# Altium project KeetV2.PrjPCB (part 3 of 6)
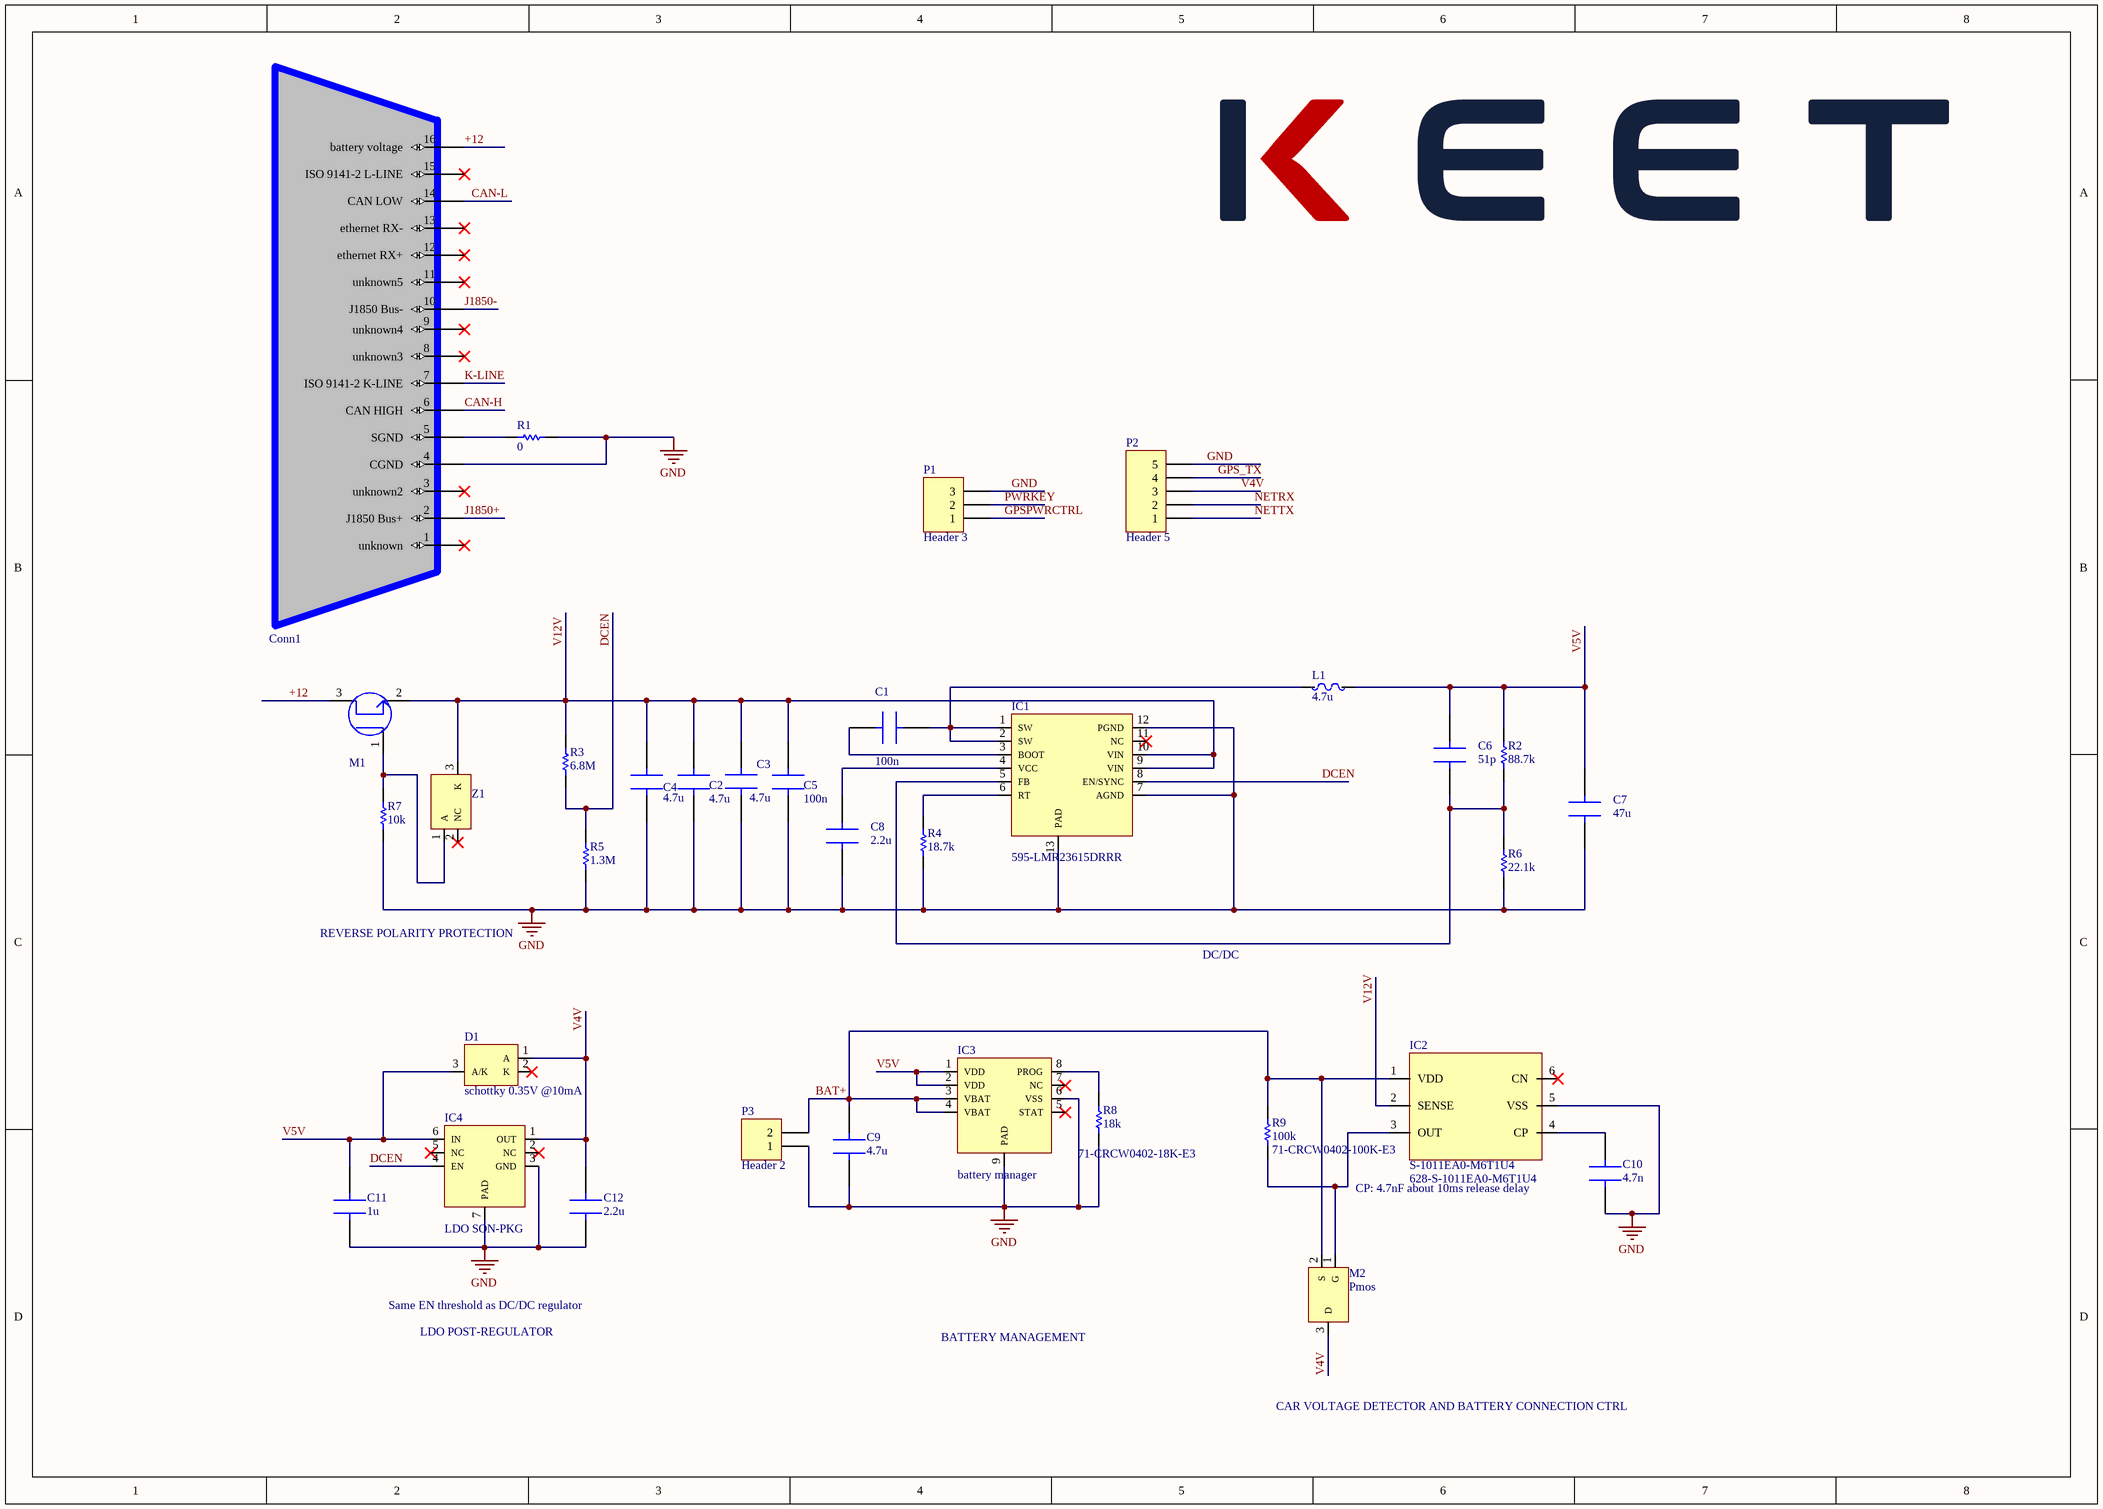
[diagram p4: PowerSupply.SchDoc]

## Sheet PowerSupply.SchDoc (continued)

### Library data of the parts (continued)
R9 = CRCW0402100KFKED: Res Thick Film 0402 100K Ohm 1% 1/16W 100ppm/C Molded SMD Paper T/R; Manufacturer: Vishay; Power Rating: 63mW; Resistance: 100kR; Temperature Coefficient: 100ppm/°C; Voltage Rating: 50V; Supplier 1: Mouser; Manufacturer Part Number: CRCW0402100KFKED; RoHS: Yes; Category: Chip SMD Resistors; Stock 1: 350931; Pricing 1: 1=0,10000, 10=0,03300, 50=0,03300, 100=0,01400, 1000=0,00600, 10000=0,00500 (USD); Mount: Surface Mount; Case/Package: 0402; Number of Pins: 2; Contact Plating: Tin; Weight: 2.3E-05oz; Case Code (Metric): 1005; Case Code (Imperial): 0402; Size Code: 0402; Min Operating Temperature: -55°C; Max Operating Temperature: 155°C; Tolerance: 1%; Resistor Type: Thick Film; Termination: SMD/SMT; Packaging: Tape and Reel; Package Quantity: 10000; Number of Terminations: 2; Max Power Dissipation: 63mW; Voltage Rating (DC): 50V; Features: Automotive AEC-Q200; Series: CRCW; Technology: THICK FILM; Construction: Rectangular; Resistance Tolerance: 1%; Length: 1mm; Width: 0.02inch; Height: 0.35mm; Depth: 0.5mm; Radiation Hardening: No; Lead Free: Lead Free; RoHS Compliant: Yes; REACH SVHC: Unknown; Military Standard: Not; ComponentLink1URL: https://datasheet.ciiva.com/11810/0900766b80d98824-11810752.pdf?src-supplier=RSComponents; ComponentLink1Description: https://datasheet.ciiva.com/11810/0900766b80d98824-11810752.pdf?src-supplier=RSComponents; ComponentLink2URL: https://datasheet.ciiva.com/26316/fld-crcw-e3-data-en-26316630.pdf?src-supplier=Distrelec; ComponentLink2Description: https://datasheet.ciiva.com/26316/fld-crcw-e3-data-en-26316630.pdf?src-supplier=Distrelec; ComponentLink3URL: https://datasheet.ciiva.com/2463/dcrcwe3-2463064.pdf?src-supplier=Digi-Key; ComponentLink3Description: https://datasheet.ciiva.com/2463/dcrcwe3-2463064.pdf?src-supplier=Digi-Key; ComponentLink4URL: https://datasheet.ciiva.com/2463/dcrcwe3-2463065.pdf?src-supplier=Digi-Key; ComponentLink4Description: https://datasheet.ciiva.com/2463/dcrcwe3-2463065.pdf?src-supplier=Digi-Key; ComponentLink5URL: https://datasheet.ciiva.com/16776/70201119-16776281.pdf?src-supplier=Allied+Electronics; ComponentLink5Description: https://datasheet.ciiva.com/16776/70201119-16776281.pdf?src-supplier=Allied+Electronics; ComponentLink6URL: https://datasheet.ciiva.com/16941/dcrcwe3-16941129.pdf?src-supplier=Avnet+Europe; ComponentLink6Description: https://datasheet.ciiva.com/16941/dcrcwe3-16941129.pdf?src-supplier=Avnet+Europe; ComponentLink7URL: https://datasheet.ciiva.com/2463/dcrcwe3-2463066.pdf?src-supplier=Digi-Key; ComponentLink7Description: https://datasheet.ciiva.com/2463/dcrcwe3-2463066.pdf?src-supplier=Digi-Key; ComponentLink8URL: https://datasheet.ciiva.com/3255/dcrcwe3-3255947.pdf?src-supplier=Avnet; ComponentLink8Description: https://datasheet.ciiva.com/3255/dcrcwe3-3255947.pdf?src-supplier=Avnet; ComponentLink9URL: https://datasheet.ciiva.com/3255/dcrcwe3-3255948.pdf?src-supplier=Avnet; ComponentLink9Description: https://datasheet.ciiva.com/3255/dcrcwe3-3255948.pdf?src-supplier=Avnet; ComponentLink10URL: https://datasheet.ciiva.com/16208/dcrcwe3-16208508.pdf?src-supplier=Future+Electronics; ComponentLink10Description: https://datasheet.ciiva.com/16208/dcrcwe3-16208508.pdf?src-supplier=Future+Electronics; ComponentLink11URL: https://datasheet.ciiva.com/5546/dcrcwe3-109170-5546638.pdf?src-supplier=Mouser; ComponentLink11Description: https://datasheet.ciiva.com/5546/dcrcwe3-109170-5546638.pdf?src-supplier=Mouser; ComponentLink12URL: https://datasheet.ciiva.com/46441/1720486-46441598.pdf?src-supplier=Element14; ComponentLink12Description: https://datasheet.ciiva.com/46441/1720486-46441598.pdf?src-supplier=Element14
Z1 = BZX84C10LT1G: ON SEMICONDUCTOR - BZX84C10LT1G - Zener Single Diode, 10 V, 225 mW, SOT-23, 6 %, 3 Pins, 150 °C; Max Power Dissipation: 225mW; Tolerance: 6%; Forward Voltage: 900mV; Max Reverse Leakage Current: 200nA; Impedance: 20R; Power Dissipation: 300mW; Test Current: 5mA; Breakdown Voltage: 10.6V; ESD Protection: Yes; Zener Current: 10mA; Supplier 1: Mouser; Manufacturer: ON Semiconductor; Manufacturer Part Number: BZX84C10LT1G; RoHS: Yes; Category: Zener Diodes; Stock 1: 59638; Pricing 1: 1=0,13000, 10=0,09200, 50=0,09200, 100=0,03900, 1000=0,02700, 10000=0,01800 (USD); Case/Package: SOT-23-3; Number of Pins: 3; Material: Plastic; Contact Plating: Tin,Matte; Min Operating Temperature: -65°C; Max Operating Temperature: 150°C; Packaging: Tape and Reel; Package Quantity: 3000; Zener Voltage: 10V; Voltage Tolerance: 6%; Working Voltage: 10V; Max Reverse Current: 200nA; Element Configuration: Single; Voltage Rating (DC): 10V; Power Rating: 225mW; Length: 0.119inch; Width: 0.055inch; Height: 0.044inch; Radiation Hardening: No; Lead Free: Lead Free; Halogen Free: Halogen Free; REACH SVHC: No SVHC; RoHS Compliant: Yes; ComponentLink1URL: https://datasheet.ciiva.com/18435/70100187-18435125.pdf?src-supplier=Allied+Electronics; ComponentLink1Description: https://datasheet.ciiva.com/18435/70100187-18435125.pdf?src-supplier=Allied+Electronics; ComponentLink2URL: https://datasheet.ciiva.com/894/bzx84c2v4lt1-d-894713.pdf?src-supplier=Digi-Key; ComponentLink2Description: https://datasheet.ciiva.com/894/bzx84c2v4lt1-d-894713.pdf?src-supplier=Digi-Key; ComponentLink3URL: https://datasheet.ciiva.com/894/bzx84c2v4lt1-d-894714.pdf?src-supplier=Digi-Key; ComponentLink3Description: https://datasheet.ciiva.com/894/bzx84c2v4lt1-d-894714.pdf?src-supplier=Digi-Key; ComponentLink4URL: https://datasheet.ciiva.com/8345/bzx84c2v4lt1-d-8345770.pdf?src-supplier=Avnet; ComponentLink4Description: https://datasheet.ciiva.com/8345/bzx84c2v4lt1-d-8345770.pdf?src-supplier=Avnet; ComponentLink5URL: https://datasheet.ciiva.com/894/bzx84c2v4lt1-d-894715.pdf?src-supplier=Digi-Key; ComponentLink5Description: https://datasheet.ciiva.com/894/bzx84c2v4lt1-d-894715.pdf?src-supplier=Digi-Key; ComponentLink6URL: https://datasheet.ciiva.com/16419/bzx84c2v4lt1-d-16419756.pdf?src-supplier=Future+Electronics; ComponentLink6Description: https://datasheet.ciiva.com/16419/bzx84c2v4lt1-d-16419756.pdf?src-supplier=Future+Electronics; ComponentLink7URL: https://datasheet.ciiva.com/8026/bzx84c2v4lt1-d-8026718.pdf?src-supplier=Element14; ComponentLink7Description: https://datasheet.ciiva.com/8026/bzx84c2v4lt1-d-8026718.pdf?src-supplier=Element14; ComponentLink8URL: https://datasheet.ciiva.com/16473/bzx84c2v4lt1-d-16473599.pdf?src-supplier=Avnet+Asia; ComponentLink8Description: https://datasheet.ciiva.com/16473/bzx84c2v4lt1-d-16473599.pdf?src-supplier=Avnet+Asia; ComponentLink9URL: https://datasheet.ciiva.com/22626/1874542-22626847.pdf?src-supplier=Element14; ComponentLink9Description: https://datasheet.ciiva.com/22626/1874542-22626847.pdf?src-supplier=Element14; Supplier Part Number 1: 863-BZX84C10LT1G

## Sheet Control.SchDoc
size A3
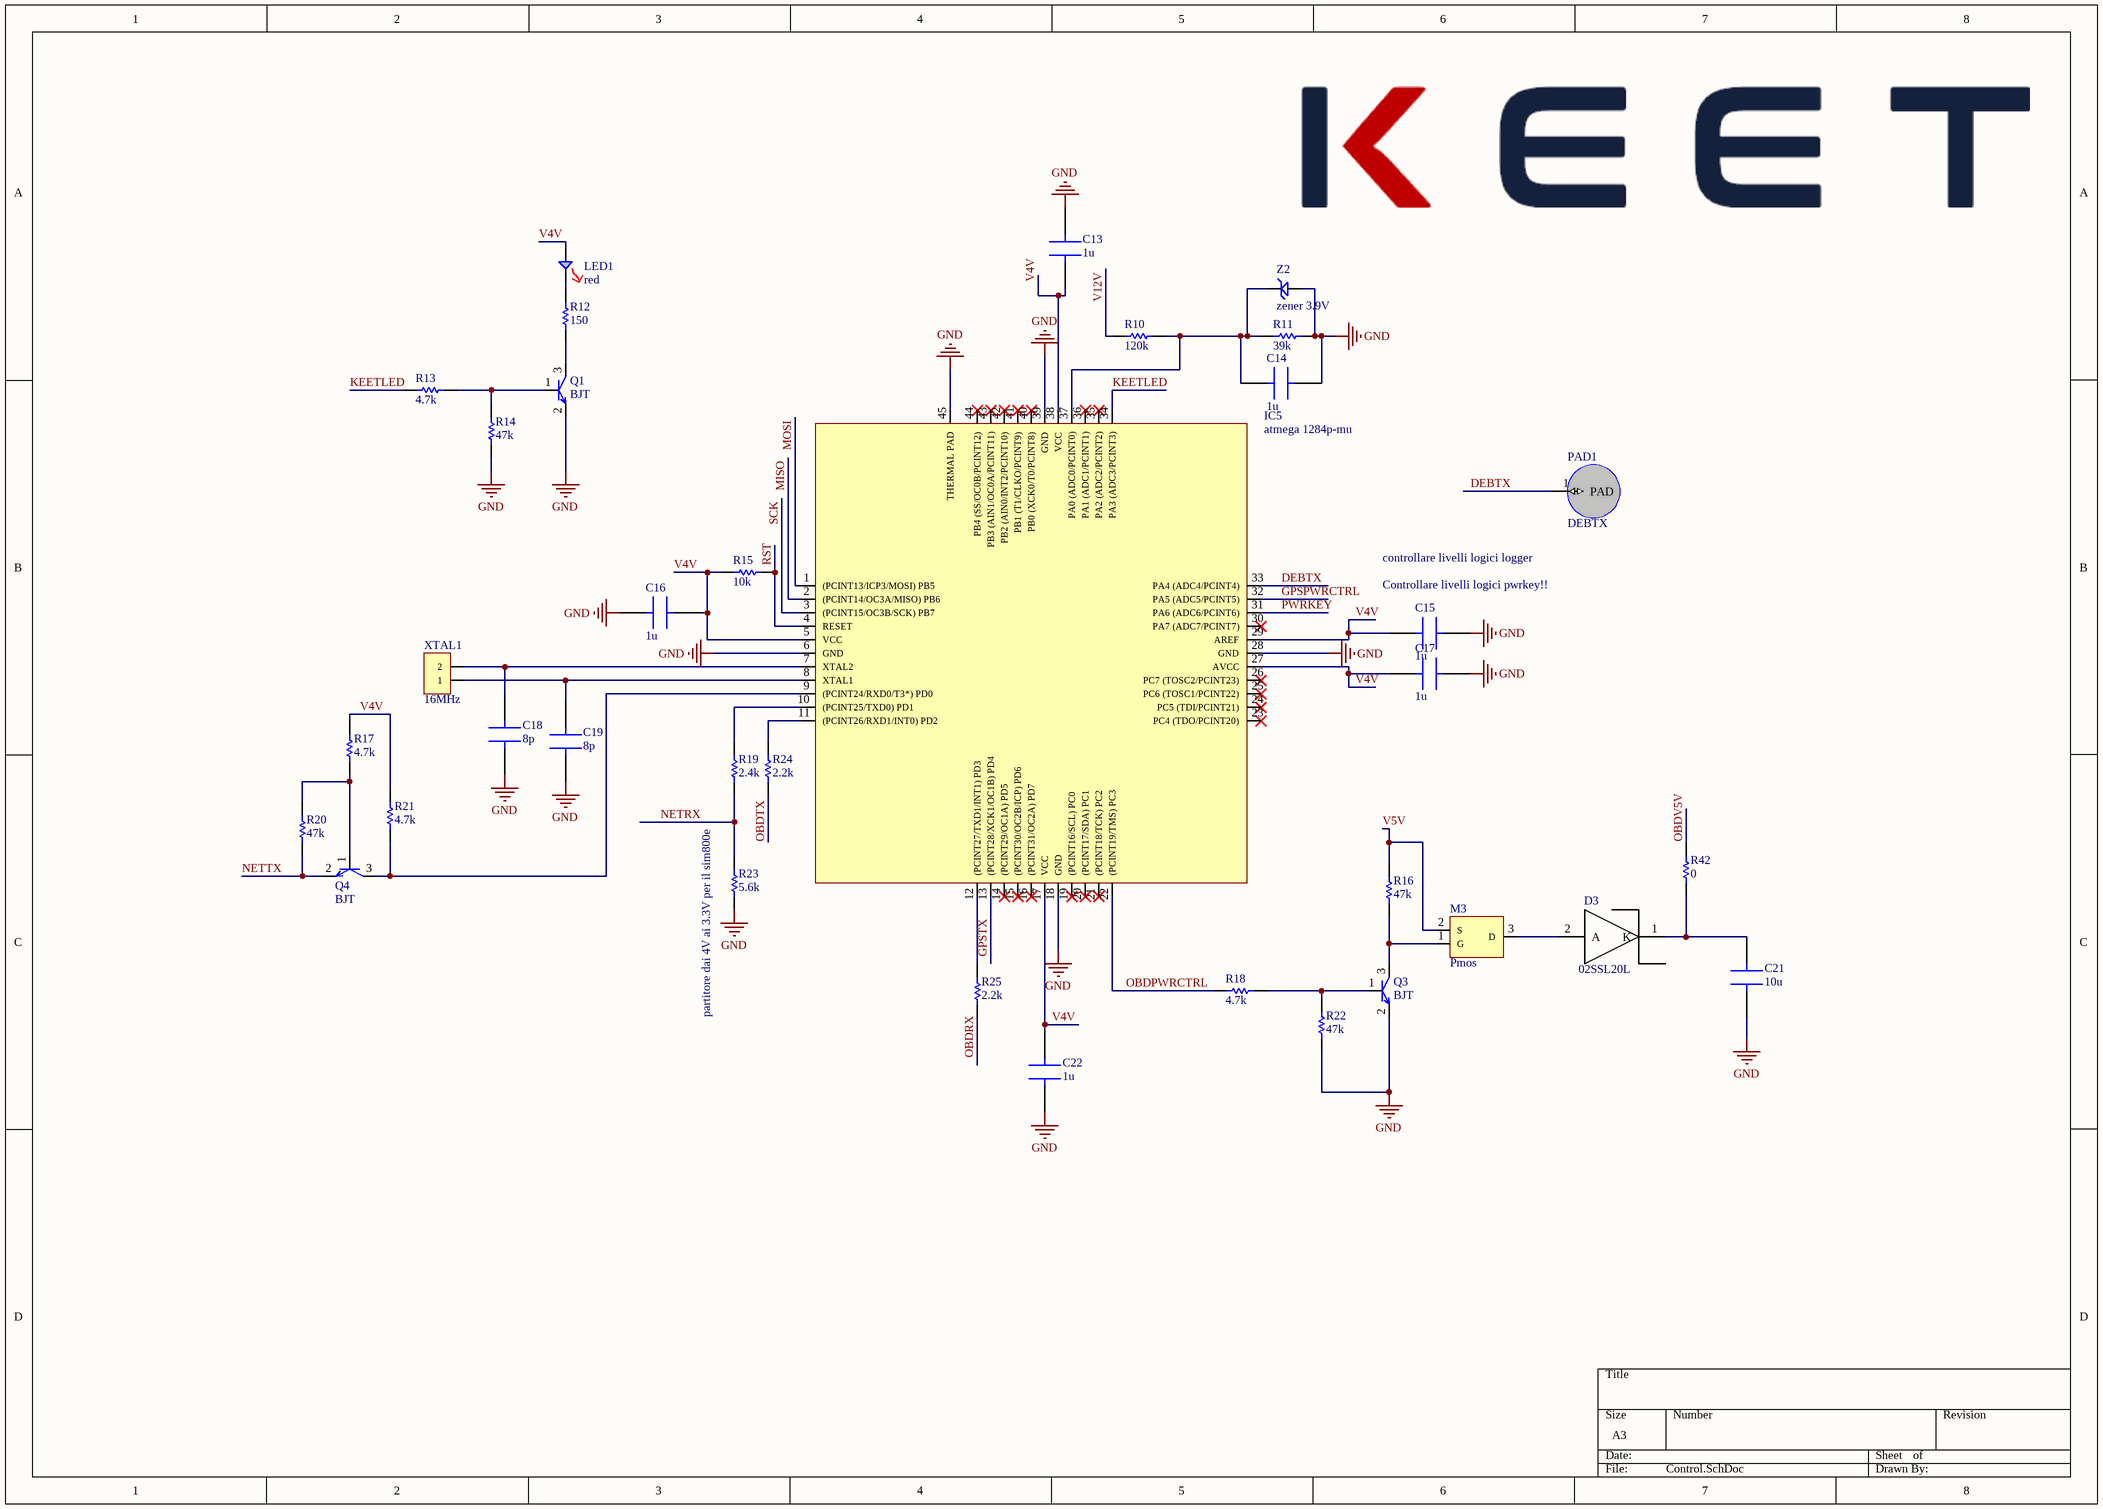
[diagram p1: Control.SchDoc]

### Parts
C13  1u  [CAPC1005X06N]
C14  1u  [CAPC1005X06N]
C15  1u  [CAPC1005X06N]
C16  1u  [CAPC1005X06N]
C17  1u  [CAPC1005X06N]
C18  8p  [CAPC1005X06N]
C19  8p  [CAPC1005X06N]
C21  10u  [CAPC1608X10N]
C22  1u  [CAPC1005X06N]
D3  02SSL20L  [SODFL370X100-2N]
IC5  atmega 1284p-mu  [QFN50P700X700X100_HS-45N]
LED1  red  [CAC-0P80X160-2N]
M3  Pmos  [SOT95P245X110-3N]
PAD1  DEBTX  [PAD]
Q1  BJT  [SOT95P245X110-3N]
Q3  BJT  [SOT95P245X110-3N]
Q4  BJT  [SOT95P245X110-3N]
R10  120k  [RESC1005X04N]
R11  39k  [RESC1005X04N]
R12  150  [RESC1005X04N]
R13  4.7k  [RESC1005X04N]
R14  47k  [RESC1005X04N]
R15  10k  [RESC1005X04N]
R16  47k  [RESC1005X04N]
R17  4.7k  [RESC1005X04N]
R18  4.7k  [RESC1005X04N]
R19  2.4k  [RESC1005X04N]
R20  47k  [RESC1005X04N]
R21  4.7k  [RESC1005X04N]
R22  47k  [RESC1005X04N]
R23  5.6k  [RESC1005X04N]
R24  2.2k  [RESC1005X04N]
R25  2.2k  [RESC1005X04N]
R42  0  [RESC1608X04N]
XTAL1  16MHz  [DFN145P200X80-2N]
Z2  zener 3.9V  [SODFL250X100-2N]

### Nets
GND: C13.2 C14.2 C15.2 C16.1 C17.2 C18.1 C19.1 C21.1 C22.1 IC5.6(GND) IC5.18(GND) IC5.28(GND) IC5.39(GND) IC5.45(THERMAL_PAD) Q1.2 Q3.2 R11.2 R14.1 R22.1 R23.1 Z2.2
DEBTX: IC5.33(PA4_(ADC4/PCINT4)) PAD1.1(PAD)
GPSPWRCTRL: IC5.32(PA5_(ADC5/PCINT5))
GPSTX: IC5.13((PCINT28/XCK1/OC1B)_PD4)
KEETLED: IC5.34(PA3_(ADC3/PCINT3)) R13.1
MISO: IC5.2((PCINT14/OC3A/MISO)_PB6)
MOSI: IC5.1((PCINT13/ICP3/MOSI)_PB5)
NETRX: R19.1 R23.2
NETTX: Q4.2 R20.1
OBDPWRCTRL: IC5.22((PCINT19/TMS)_PC3) R18.1
OBDRX: R25.1
OBDTX: R24.1
OBDV5V: R42.2
PWRKEY: IC5.31(PA6_(ADC6/PCINT6))
RST: IC5.4(RESET) R15.2
SCK: IC5.3((PCINT15/OC3B/SCK)_PB7)
V4V: C13.1 C15.1 C16.2 C17.1 C22.2 IC5.5(VCC) IC5.17(VCC) IC5.27(AVCC) IC5.29(AREF) IC5.38(VCC) LED1.2 R15.1 R17.2 R21.2
V5V: M3.2(S) R16.2
V12V: R10.1
NetC14_1: C14.1 IC5.37(PA0_(ADC0/PCINT0)) R10.2 R11.1 Z2.1
NetC18_2: C18.2 IC5.7(XTAL2) XTAL1.2
NetC19_2: C19.2 IC5.8(XTAL1) XTAL1.1
NetC21_2: C21.2 D3.1(K) R42.1
NetD3_2: D3.2(A) M3.3(D)
NetIC5_9: IC5.9((PCINT24/RXD0/T3*)_PD0) Q4.3 R21.1
NetIC5_10: IC5.10((PCINT25/TXD0)_PD1) R19.2
NetIC5_11: IC5.11((PCINT26/RXD1/INT0)_PD2) R24.2
NetIC5_12: IC5.12((PCINT27/TXD1/INT1)_PD3) R25.2
NetLED1_1: LED1.1 R12.2
NetM3_1: M3.1(G) Q3.3 R16.1
NetQ1_1: Q1.1 R13.2 R14.2
NetQ1_3: Q1.3 R12.1
NetQ3_1: Q3.1 R18.2 R22.2
NetQ4_1: Q4.1 R17.1 R20.2

Not connected (* = marked no-connect by the designer): IC5 14((PCINT29/OC1A)_PD5)* 15((PCINT30/OC2B/ICP)_PD6)* 16((PCINT31/OC2A)_PD7)* 19((PCINT16/SCL)_PC0)* 20((PCINT17/SDA)_PC1)* 21((PCINT18/TCK)_PC2)* 23(PC4_(TDO/PCINT20))* 24(PC5_(TDI/PCINT21))* 25(PC6_(TOSC1/PCINT22))* 26(PC7_(TOSC2/PCINT23))* 30(PA7_(ADC7/PCINT7))* 35(PA2_(ADC2/PCINT2))* 36(PA1_(ADC1/PCINT1))* 40(PB0_(XCK0/T0/PCINT8))* 41(PB1_(T1/CLKO/PCINT9))* 42(PB2_(AIN0/INT2/PCINT10))* 43(PB3_(AIN1/OC0A/PCINT11))* 44(PB4_(SS/OC0B/PCINT12))*

### Notes on the sheet
- (near C15) Controllare livelli logici pwrkey!!
- controllare livelli logici logger
- partitore dai 4V ai 3.3V per il sim800e

### Library data of the parts
C13-C17 C22 = EMK105BJ105KVHF: TAIYO YUDEN - EMK105BJ105KVHF - CAPACITOR,CERAMIC,0402,16V,X5R,1 F, 10% ROHS COMPLIANT: YES; Capacitance: 1uF; Supplier 1: Mouser; Manufacturer: Taiyo Yuden; Manufacturer Part Number: EMK105BJ105KVHF; RoHS: Yes; Category: Ceramic Capacitors; Stock 1: 62407; Pricing 1: 1=0,10000, 10=0,06700, 50=0,06700, 100=0,02900, 1000=0,01500, 10000=0,01100 (USD); Mount: Surface Mount; Case/Package: 0402; Case Code (Metric): 1005; Case Code (Imperial): 0402; Weight: 2.3E-05oz; Min Operating Temperature: -55°C; Max Operating Temperature: 85°C; Voltage Rating: 16V; Package Quantity: 10000; Packaging: Tape and Reel; Tolerance: 10%; Dielectric: X5R; Termination: SMD/SMT; Voltage Rating (DC): 16V; Length: 0.039inch; Width: 0.5mm; Height: 0.5mm; Thickness: 0.022inch; Ratings: AEC-Q200; Lead Free: Lead Free; Halogen Free: Halogen Free; RoHS Compliant: Yes; ComponentLink1URL: http://www.mouser.com/ds/2/396/mlcc11_hq_e-541564.pdf?src-supplier=Mouser; ComponentLink1Description: http://www.mouser.com/ds/2/396/mlcc11_hq_e-541564.pdf?src-supplier=Mouser; ComponentLink2URL: http://www.yuden.co.jp/eu/product/category/capacitor/putpdf/EMK105BJ105KVHF.pdf?src-supplier=Avnet; ComponentLink2Description: http://www.yuden.co.jp/eu/product/category/capacitor/putpdf/EMK105BJ105KVHF.pdf?src-supplier=Avnet; ComponentLink3URL: https://www.yuden.co.jp/productdata/catalog/mlcc01_hq_e.pdf?src-supplier=Digi-Key; ComponentLink3Description: https://www.yuden.co.jp/productdata/catalog/mlcc01_hq_e.pdf?src-supplier=Digi-Key; ComponentLink4URL: http://ds.yuden.co.jp/TYCOMPAS/ut/detail.do?productNo=EMK105BJ105KVHF&fileName=EMK105BJ105KVHF_SS&mode=specSheetDownload&src-supplier=Digi-Key; ComponentLink4Description: http://ds.yuden.co.jp/TYCOMPAS/ut/detail.do?productNo=EMK105BJ105KVHF&fileName=EMK105BJ105KVHF_SS&mode=specSheetDownload&src-supplier=Digi-Key; ComponentLink5URL: http://www.farnell.com/datasheets/2819903.pdf?src-supplier=Newark; ComponentLink5Description: http://www.farnell.com/datasheets/2819903.pdf?src-supplier=Newark; Supplier Part Number 1: 963-EMK105BJ105KVHF
C18 C19 = GCM1555C1H8R0FA16D: Cap Ceramic 8pF 50V C0G 1% SMD 0402 125C Paper T/R; Manufacturer: Murata; Supplier 1: Mouser; Manufacturer Part Number: GCM1555C1H8R0FA16D; RoHS: Yes; Category: Ceramic Capacitors; Stock 1: 10967; Pricing 1: 1=0,13000, 10=0,10100, 50=0,10100, 100=0,04700, 1000=0,02700, 10000=0,01900 (USD); Case/Package: 0402; Min Operating Temperature: -55°C; Max Operating Temperature: 125°C; Packaging: Tape and Reel; Tolerance: 1%; Dielectric: C0G; Capacitance: 8pF; Length: 1mm; Depth: 0.5mm; RoHS Compliant: Yes; ComponentLink1URL: http://components.arrow.com/part/dataview/0323_07106307?src-supplier=Arrow+Europe; ComponentLink1Description: http://components.arrow.com/part/dataview/0323_07106307?src-supplier=Arrow+Europe; Supplier Part Number 1: 81-GCM1555C1H8R0FA6D
C21 = C1608X5R1A106K080AC: TDK         C1608X5R1A106K080AC.            CERAMIC CAPACITOR, 10UF, 10V, X5R, 10%, 0603, FULL REEL; Supplier 1: Mouser; Manufacturer: TDK; Manufacturer Part Number: C1608X5R1A106K080AC; RoHS: Yes; Category: Ceramic Capacitors; Stock 1: 428553; Pricing 1: 1=0,33000, 10=0,21300, 50=0,21300, 100=0,17800, 1000=0,11600, 10000=0,11600 (USD); Mount: Surface Mount; Case/Package: 0603; Number of Pins: 2; Case Code (Imperial): 0603; Case Code (Metric): 1608; Weight: 7.1E-05oz; Dielectric Material: Ceramic; Min Operating Temperature: -55°C; Max Operating Temperature: 85°C; Capacitance: 10uF; Tolerance: 10%; Voltage Rating: 10V; Voltage Rating (DC): 10V; Packaging: Tape and Reel; Package Quantity: 1; Termination: SMD/SMT; Dielectric: X5R; Series: C; Construction: Flat; Resistor Type: Ceramic; Voltage: 10V; Length: 1.6mm; Width: 0.8mm; Height: 0.8mm; Depth: 0.8mm; Thickness: 0.035inch; Radiation Hardening: No; RoHS Compliant: Yes; Lead Free: Lead Free; REACH SVHC: No SVHC; ComponentLink1URL: https://datasheet.ciiva.com/16449/mlcc-commercial-general-en-16449573.pdf?src-supplier=Future+Electronics; ComponentLink1Description: https://datasheet.ciiva.com/16449/mlcc-commercial-general-en-16449573.pdf?src-supplier=Future+Electronics; ComponentLink2URL: https://datasheet.ciiva.com/48671/e412-c-48671301.pdf?src-supplier=Avnet; ComponentLink2Description: https://datasheet.ciiva.com/48671/e412-c-48671301.pdf?src-supplier=Avnet; ComponentLink3URL: https://datasheet.ciiva.com/22694/1796654-22694118.pdf?src-supplier=Element14; ComponentLink3Description: https://datasheet.ciiva.com/22694/1796654-22694118.pdf?src-supplier=Element14; ComponentLink4URL: https://datasheet.ciiva.com/17487/e412-c-17487511.pdf?src-supplier=Avnet+Europe; ComponentLink4Description: https://datasheet.ciiva.com/17487/e412-c-17487511.pdf?src-supplier=Avnet+Europe; ComponentLink5URL: https://datasheet.ciiva.com/7975/1796654-7975065.pdf?src-supplier=Element14; ComponentLink5Description: https://datasheet.ciiva.com/7975/1796654-7975065.pdf?src-supplier=Element14; ComponentLink6URL: https://datasheet.ciiva.com/23802/1796654-23802763.pdf?src-supplier=Newark; ComponentLink6Description: https://datasheet.ciiva.com/23802/1796654-23802763.pdf?src-supplier=Newark; ComponentLink7URL: https://datasheet.ciiva.com/6288/tdkmlcccaprange-6288220.pdf?src-supplier=Digi-Key; ComponentLink7Description: https://datasheet.ciiva.com/6288/tdkmlcccaprange-6288220.pdf?src-supplier=Digi-Key; ComponentLink8URL: https://datasheet.ciiva.com/28577/mlcc-commercial-general-en-28577085.pdf?src-supplier=Element14; ComponentLink8Description: https://datasheet.ciiva.com/28577/mlcc-commercial-general-en-28577085.pdf?src-supplier=Element14; ComponentLink9URL: https://datasheet.ciiva.com/6288/tdkmlcccaprange-6288222.pdf?src-supplier=Digi-Key; ComponentLink9Description: https://datasheet.ciiva.com/6288/tdkmlcccaprange-6288222.pdf?src-supplier=Digi-Key; ComponentLink10URL: https://datasheet.ciiva.com/6288/tdkmlcccaprange-6288223.pdf?src-supplier=Digi-Key; ComponentLink10Description: https://datasheet.ciiva.com/6288/tdkmlcccaprange-6288223.pdf?src-supplier=Digi-Key; ComponentLink11URL: https://datasheet.ciiva.com/28577/1744655-28577071.pdf?src-supplier=Element14; ComponentLink11Description: https://datasheet.ciiva.com/28577/1744655-28577071.pdf?src-supplier=Element14; Supplier Part Number 1: 810-C1608X5R1A106K
D3 = 02SSL20L: SCHOTTKY DIODE https://eu.mouser.com/datasheet/2/345/02ssl20l-02ssl40l-1107799.pdf
IC5 = ATMEGA1284P-MU: MCU 8-bit ATmega AVR RISC 128KB Flash 2.5V/3.3V/5V 44-Pin VQFN EP; Manufacturer: Microchip / Atmel; Interface: SPI,USART,2-Wire,I2C,UART; Frequency: 20MHz; Data Bus Width: 8b; RAM Size: 16KB; Number of I/Os: 32; Oscillator Type: Internal; Peripherals: Brown-out Detect/Reset,POR,PWM,WDT; Number of Timers/Counters: 3; Max Supply Voltage: 5.5V; Min Supply Voltage: 1.8V; Watchdog Timer: Yes; Number of PWM Channels: 6; Number of ADC Channels: 8; Number of SPI Channels: 1; Supplier 1: Mouser; Manufacturer Part Number: ATMEGA1284P-MU; RoHS: Yes; Category: Microcontrollers; Stock 1: 90; Pricing 1: 1=5,55000, 10=5,55000, 50=5,09000, 100=4,61000, 1000=4,61000, 10000=4,61000 (USD); Mount: Surface Mount; Case/Package: VQFN EP; Number of Pins: 44; Contact Plating: Tin,Matte; Min Operating Temperature: -40°C; Max Operating Temperature: 85°C; Packaging: Tray; Memory Size: 128KB; Package Quantity: 360; Memory Type: FLASH; Core Architecture: AVR; Number of Programmable I/O: 32; Max Frequency: 20MHz; Series: AVR® ATmega; Number of I2C Channels: 1; Length: 7.1mm; Width: 7.1mm; Height: 0.95mm; Radiation Hardening: No; RoHS Compliant: Yes; REACH SVHC: No SVHC; Lead Free: Lead Free; ComponentLink1URL: https://datasheet.ciiva.com/4839/doc8272-71643-4839072.pdf?src-supplier=Mouser; ComponentLink1Description: https://datasheet.ciiva.com/4839/doc8272-71643-4839072.pdf?src-supplier=Mouser; ComponentLink2URL: https://datasheet.ciiva.com/26818/atmega1284p-mu-26818543.pdf?src-supplier=IIIC; ComponentLink2Description: https://datasheet.ciiva.com/26818/atmega1284p-mu-26818543.pdf?src-supplier=IIIC; ComponentLink3URL: https://datasheet.ciiva.com/9235/doc8272-9235016.pdf?src-supplier=Avnet; ComponentLink3Description: https://datasheet.ciiva.com/9235/doc8272-9235016.pdf?src-supplier=Avnet; ComponentLink4URL: https://datasheet.ciiva.com/1157/1712449-1157226.pdf?src-supplier=Element14; ComponentLink4Description: https://datasheet.ciiva.com/1157/1712449-1157226.pdf?src-supplier=Element14; ComponentLink5URL: https://datasheet.ciiva.com/24154/doc8272-24154058.pdf?src-supplier=Future+Electronics; ComponentLink5Description: https://datasheet.ciiva.com/24154/doc8272-24154058.pdf?src-supplier=Future+Electronics; ComponentLink6URL: https://datasheet.ciiva.com/15213/getdatasheetpartid-187398-15213067.pdf?src-supplier=Verical; ComponentLink6Description: https://datasheet.ciiva.com/15213/getdatasheetpartid-187398-15213067.pdf?src-supplier=Verical; Supplier Part Number 1: 556-ATMEGA1284P-MU
LED1 = 150060RS75000: WURTH ELEKTRONIK - 150060RS75000 - LED, Red, 625 nm, 2 V, 30 mA, 250 mcd RoHS Compliant: Yes; Manufacturer: Wurth Electronics; Viewing Angle: 140°; Lens Style: Clear,Rectangular; Luminous Intensity: 250mcd; Forward Current: 30mA; Forward Voltage: 2V; Wavelength: 625nm; Test Current: 20mA; Supplier 1: Mouser; Manufacturer Part Number: 150060RS75000; RoHS: Yes; Category: LEDs; Stock 1: 64382; Pricing 1: 1=0,15000, 10=0,15000, 50=0,13300, 100=0,11400, 1000=0,10600, 10000=0,10600 (USD); Mount: Surface Mount; Case/Package: 0603; Color: Red; Case Code (Metric): 1608; Case Code (Imperial): 0603; Min Operating Temperature: -40°C; Max Operating Temperature: 85°C; Package Quantity: 1; Packaging: Cut Tape; Dominant Wavelength: 625nm; Length: 1.6mm; Width: 0.8mm; Height: 0.7mm; REACH SVHC: Unknown; RoHS Compliant: Yes; ComponentLink1URL: https://datasheet.ciiva.com/29563/150060rs75000-29563040.pdf?src-supplier=Digi-Key; ComponentLink1Description: https://datasheet.ciiva.com/29563/150060rs75000-29563040.pdf?src-supplier=Digi-Key; ComponentLink2URL: https://datasheet.ciiva.com/29279/759428-da-01-en-chipled-0603-w-kl-rot-150060rs75000-29279196.pdf?src-supplier=Conrad; ComponentLink2Description: https://datasheet.ciiva.com/29279/759428-da-01-en-chipled-0603-w-kl-rot-150060rs75000-29279196.pdf?src-supplier=Conrad; Supplier Part Number 1: 710-150060RS75000
M3 = DMP1045U-7: P-Channel 12 V 31 mOhm Surface Mount Enhancement Mode Mosfet - SOT-23-3; Manufacturer: Diodes; Rise Time: 23.3ns; Continuous Drain Current (ID): 4A; Gate to Source Voltage (Vgs): 8V; Fall Time: 106.9ns; Turn-Off Delay Time: 91.2ns; Turn-On Delay Time: 15.7ns; Rds On Max: 31mR; Input Capacitance: 1.357nF; Drain to Source Voltage (Vdss): 12V; Max Power Dissipation: 800mW; Number of Elements: 1; Power Dissipation: 1.3W; Element Configuration: Single; Drain to Source Breakdown Voltage: -12V; Supplier 1: Mouser; Manufacturer Part Number: DMP1045U-7; RoHS: Yes; Category: MOSFETs; Stock 1: 8272; Pricing 1: 1=0,41000, 10=0,27800, 50=0,27800, 100=0,14500, 1000=0,10100, 10000=0,07800 (USD); Mount: Surface Mount; Case/Package: SOT-23; Number of Pins: 3; Weight: 0.000282oz; Contact Plating: Tin,Matte; Min Operating Temperature: -55°C; Max Operating Temperature: 150°C; Package Quantity: 3000; Packaging: Tape and Reel; Drain to Source Resistance: 31mR; Number of Channels: 1; Polarity: P-CHANNEL; Series: DMP1045; Length: 3mm; Width: 1.4mm; Height: 1.1mm; Radiation Hardening: No; REACH SVHC: No SVHC; Lead Free: Lead Free; RoHS Compliant: Yes; ComponentLink1URL: https://datasheet.ciiva.com/11176/dmp1045u-11176581.pdf?src-supplier=Avnet; ComponentLink1Description: https://datasheet.ciiva.com/11176/dmp1045u-11176581.pdf?src-supplier=Avnet; ComponentLink2URL: https://datasheet.ciiva.com/17323/dmp1045u-17323644.pdf?src-supplier=Avnet+Europe; ComponentLink2Description: https://datasheet.ciiva.com/17323/dmp1045u-17323644.pdf?src-supplier=Avnet+Europe; ComponentLink3URL: https://datasheet.ciiva.com/18648/dmp1045u-18648300.pdf?src-supplier=Digi-Key; ComponentLink3Description: https://datasheet.ciiva.com/18648/dmp1045u-18648300.pdf?src-supplier=Digi-Key; Supplier Part Number 1: 621-DMP1045U-7
PAD1 = PAD: just a pad
Q1 Q3 Q4 = BC850CLT1G: ON SEMICONDUCTOR   BC850CLT1G   BIPOLAR TRANSISTOR, NPN, 45V SOT-23; Max Power Dissipation: 225mW; Max Collector Current: 100mA; Transition Frequency: 100MHz; Collector Base Voltage (VCBO): 50V; Number of Elements: 1; hFE Min: 420; Emitter Base Voltage (VEBO): 6V; Collector Emitter Saturation Voltage: 600mV; Power Dissipation: 300mW; Element Configuration: Single; Supplier 1: Mouser; Manufacturer: ON Semiconductor; Manufacturer Part Number: BC850CLT1G; RoHS: Yes; Category: BJTs; Stock 1: 123785; Pricing 1: 1=0,11000, 10=0,09800, 50=0,09800, 100=0,03400, 1000=0,02400, 10000=0,01500 (USD); Case/Package: SOT-23-3; Number of Pins: 3; Contact Plating: Tin,Matte; Min Operating Temperature: -55°C; Max Operating Temperature: 150°C; Collector Emitter Voltage (VCEO): 45V; Packaging: Tape and Reel; Collector Emitter Breakdown Voltage: 45V; Frequency: 100MHz; Package Quantity: 1; Max Breakdown Voltage: 45V; Polarity: NPN; Max Frequency: 100MHz; Gain Bandwidth Product: 100MHz; Voltage Rating (DC): 45V; Current Rating: 100mA; Series: -; Collector-emitter Voltage-Max: 600mV; Length: 2.9mm; Width: 1.3mm; Height: 0.94mm; Radiation Hardening: No; RoHS Compliant: Yes; Lead Free: Lead Free; REACH SVHC: No SVHC; ComponentLink1URL: https://datasheet.ciiva.com/976/bc846alt1-d-976401.pdf?src-supplier=Digi-Key; ComponentLink1Description: https://datasheet.ciiva.com/976/bc846alt1-d-976401.pdf?src-supplier=Digi-Key; ComponentLink2URL: https://datasheet.ciiva.com/976/bc846alt1-d-976402.pdf?src-supplier=Digi-Key; ComponentLink2Description: https://datasheet.ciiva.com/976/bc846alt1-d-976402.pdf?src-supplier=Digi-Key; ComponentLink3URL: https://datasheet.ciiva.com/976/bc846alt1-d-976403.pdf?src-supplier=Digi-Key; ComponentLink3Description: https://datasheet.ciiva.com/976/bc846alt1-d-976403.pdf?src-supplier=Digi-Key; ComponentLink4URL: https://datasheet.ciiva.com/7971/1571861-7971973.pdf?src-supplier=Element14; ComponentLink4Description: https://datasheet.ciiva.com/7971/1571861-7971973.pdf?src-supplier=Element14; ComponentLink5URL: https://datasheet.ciiva.com/11204/bc846alt1-d-11204376.pdf?src-supplier=Avnet; ComponentLink5Description: https://datasheet.ciiva.com/11204/bc846alt1-d-11204376.pdf?src-supplier=Avnet; ComponentLink6URL: https://datasheet.ciiva.com/25997/bc846alt1-d-25997003.pdf?src-supplier=Avnet+Europe; ComponentLink6Description: https://datasheet.ciiva.com/25997/bc846alt1-d-25997003.pdf?src-supplier=Avnet+Europe; ComponentLink7URL: https://datasheet.ciiva.com/7972/bc846alt1-d-7972206.pdf?src-supplier=Element14; ComponentLink7Description: https://datasheet.ciiva.com/7972/bc846alt1-d-7972206.pdf?src-supplier=Element14; ComponentLink8URL: https://datasheet.ciiva.com/16291/bc846alt1-d-16291503.pdf?src-supplier=Future+Electronics; ComponentLink8Description: https://datasheet.ciiva.com/16291/bc846alt1-d-16291503.pdf?src-supplier=Future+Electronics; Supplier Part Number 1: 863-BC850CLT1G
R10 = ERJ2RKD1203X: Res Thick Film 0402 120K Ohm 0.5% 0.063W(1/16W) ±100ppm/C Molded SMD Automotive Punched T/R; Manufacturer: Panasonic; Resistance: 120kR; Power Rating: 63mW; Voltage Rating: 50V; Temperature Coefficient: 100ppm/°C; Supplier 1: Mouser; Manufacturer Part Number: ERJ2RKD1203X; RoHS: Yes; Category: Chip SMD Resistors; Stock 1: 15368; Pricing 1: 1=0,14000, 10=0,07200, 50=0,07200, 100=0,04100, 1000=0,02300, 10000=0,01600 (USD); Mount: Surface Mount; Case/Package: 0402; Case Code (Metric): 1005; Case Code (Imperial): 0402; Contact Plating: Tin; Min Operating Temperature: -55°C; Max Operating Temperature: 125°C; Packaging: Cut Tape; Tolerance: 0.5%; Resistor Type: Thick Film; Termination: Solder; Voltage Rating (DC): 50V; Resistance Tolerance: 0.5%; Technology: THICK FILM; Construction: Rectangular; Length: 1mm; Height: 0.35mm; Depth: 0.5mm; REACH SVHC: No SVHC; Military Standard: Not; RoHS Compliant: Yes; ComponentLink1URL: https://datasheet.ciiva.com/9186/aoa0000ce2-9186232.pdf?src-supplier=Avnet; ComponentLink1Description: https://datasheet.ciiva.com/9186/aoa0000ce2-9186232.pdf?src-supplier=Avnet; ComponentLink2URL: https://datasheet.ciiva.com/28675/1678782-28675655.pdf?src-supplier=Element14; ComponentLink2Description: https://datasheet.ciiva.com/28675/1678782-28675655.pdf?src-supplier=Element14; Supplier Part Number 1: 667-ERJ-2RKD1203X
R11 = ERJ2RHD3902X: Res Thick Film 0402 39K Ohm 0.5% 0.063W(1/16W) ±50ppm/C Molded SMD Automotive Punched T/R; Manufacturer: Panasonic; Resistance: 39kR; Power Rating: 63mW; Voltage Rating: 50V; Temperature Coefficient: 50ppm/°C; Supplier 1: Mouser; Manufacturer Part Number: ERJ2RHD3902X; RoHS: Yes; Category: Chip SMD Resistors; Stock 1: 27224; Pricing 1: 1=0,10000, 10=0,04900, 50=0,04900, 100=0,02700, 1000=0,01600, 10000=0,01100 (USD); Mount: Surface Mount; Case/Package: 0402; Case Code (Metric): 1005; Case Code (Imperial): 0402; Min Operating Temperature: -55°C; Max Operating Temperature: 155°C; Tolerance: 0.5%; Packaging: Cut Tape; Resistor Type: Thick Film; Termination: Solder; Voltage Rating (DC): 50V; Length: 1mm; Height: 0.35mm; Depth: 0.5mm; REACH SVHC: No SVHC; Military Standard: Not; RoHS Compliant: Yes; ComponentLink1URL: http://www.alliedelec.com/m/d/623f45ff1957d936ff56d46fd1c28cac.pdf?src-supplier=Allied+Electronics; ComponentLink1Description: http://www.alliedelec.com/m/d/623f45ff1957d936ff56d46fd1c28cac.pdf?src-supplier=Allied+Electronics; ComponentLink2URL: http://components.arrow.com/part/dataview/0323_02919458?src-supplier=Arrow+Europe; ComponentLink2Description: http://components.arrow.com/part/dataview/0323_02919458?src-supplier=Arrow+Europe; ComponentLink3URL: http://www.farnell.com/datasheets/1911175.pdf?src-supplier=Farnell; ComponentLink3Description: http://www.farnell.com/datasheets/1911175.pdf?src-supplier=Farnell; ComponentLink4URL: http://www.farnell.com/datasheets/1678782.pdf?src-supplier=Element14; ComponentLink4Description: http://www.farnell.com/datasheets/1678782.pdf?src-supplier=Element14; ComponentLink5URL: http://www.farnell.com/datasheets/1911175.pdf?src-supplier=Element14; ComponentLink5Description: http://www.farnell.com/datasheets/1911175.pdf?src-supplier=Element14; Supplier Part Number 1: 667-ERJ-2RHD3902X
R12 = ERJ-2RKF1500X: RES SMD 150 OHM 1% 1/10W 0402; Manufacturer: Panasonic; Resistance: 150R; Temperature Coefficient: 100ppm/°C; Power Rating: 100mW; Voltage Rating: 50V; Supplier 1: Mouser; Manufacturer Part Number: ERJ-2RKF1500X; RoHS: Yes; Category: Chip SMD Resistors; Stock 1: 497660; Pricing 1: 1=0,10000, 10=0,02200, 50=0,02200, 100=0,00900, 1000=0,00400, 10000=0,00300 (USD); Mount: Surface Mount; Case/Package: 0402; Number of Pins: 2; Contact Plating: Tin; Case Code (Metric): 1005; Case Code (Imperial): 0402; Size Code: 0402; Min Operating Temperature: -55°C; Max Operating Temperature: 155°C; Tolerance: 1%; Resistor Type: Thick Film; Packaging: Tape and Reel; Package Quantity: 1; Number of Terminations: 2; Termination: SMD/SMT; Max Power Dissipation: 100mW; Voltage Rating (DC): 50V; Features: Automotive AEC-Q200; Series: ERJ; Resistance Tolerance: 1%; Technology: THICK FILM; Construction: Rectangular; Length: 1mm; Width: 0.02inch; Height: 0.35mm; Depth: 0.5mm; Radiation Hardening: No; REACH SVHC: No SVHC; Military Standard: Not; Lead Free: Lead Free; RoHS Compliant: Yes; ComponentLink1URL: https://datasheet.ciiva.com/34303/1987126-34303555.pdf?src-supplier=Jameco; ComponentLink1Description: https://datasheet.ciiva.com/34303/1987126-34303555.pdf?src-supplier=Jameco; ComponentLink2URL: https://datasheet.ciiva.com/11821/0900766b80f80784-11821183.pdf?src-supplier=RSComponents; ComponentLink2Description: https://datasheet.ciiva.com/11821/0900766b80f80784-11821183.pdf?src-supplier=RSComponents; ComponentLink3URL: https://datasheet.ciiva.com/16774/70260748-16774549.pdf?src-supplier=Allied+Electronics; ComponentLink3Description: https://datasheet.ciiva.com/16774/70260748-16774549.pdf?src-supplier=Allied+Electronics; ComponentLink4URL: https://datasheet.ciiva.com/43467/1678782-43467237.pdf?src-supplier=Farnell; ComponentLink4Description: https://datasheet.ciiva.com/43467/1678782-43467237.pdf?src-supplier=Farnell; ComponentLink5URL: https://datasheet.ciiva.com/7887/426256-7887016.pdf?src-supplier=Element14; ComponentLink5Description: https://datasheet.ciiva.com/7887/426256-7887016.pdf?src-supplier=Element14; ComponentLink6URL: https://datasheet.ciiva.com/16371/aoa0000ce2-16371497.pdf?src-supplier=Future+Electronics; ComponentLink6Description: https://datasheet.ciiva.com/16371/aoa0000ce2-16371497.pdf?src-supplier=Future+Electronics; ComponentLink7URL: https://datasheet.ciiva.com/7886/aoa0000ce2-7886714.pdf?src-supplier=Element14; ComponentLink7Description: https://datasheet.ciiva.com/7886/aoa0000ce2-7886714.pdf?src-supplier=Element14; ComponentLink8URL: https://datasheet.ciiva.com/46373/1678782-46373162.pdf?src-supplier=Element14; ComponentLink8Description: https://datasheet.ciiva.com/46373/1678782-46373162.pdf?src-supplier=Element14; ComponentLink9URL: https://datasheet.ciiva.com/46373/1678782-46373163.pdf?src-supplier=Element14; ComponentLink9Description: https://datasheet.ciiva.com/46373/1678782-46373163.pdf?src-supplier=Element14; ComponentLink10URL: https://datasheet.ciiva.com/16770/70260748-16770572.pdf?src-supplier=Allied+Electronics; ComponentLink10Description: https://datasheet.ciiva.com/16770/70260748-16770572.pdf?src-supplier=Allied+Electronics; ComponentLink11URL: https://datasheet.ciiva.com/17207/aoa0000ce2-17207389.pdf?src-supplier=Avnet+Europe; ComponentLink11Description: https://datasheet.ciiva.com/17207/aoa0000ce2-17207389.pdf?src-supplier=Avnet+Europe; ComponentLink12URL: https://datasheet.ciiva.com/28568/1678782-28568846.pdf?src-supplier=Element14; ComponentLink12Description: https://datasheet.ciiva.com/28568/1678782-28568846.pdf?src-supplier=Element14; ComponentLink13URL: https://datasheet.ciiva.com/30106/aoa0000ce2-30106926.pdf?src-supplier=Onlinecomponents.com; ComponentLink13Description: https://datasheet.ciiva.com/30106/aoa0000ce2-30106926.pdf?src-supplier=Onlinecomponents.com; ComponentLink14URL: https://datasheet.ciiva.com/22673/1678782-22673679.pdf?src-supplier=Element14; ComponentLink14Description: https://datasheet.ciiva.com/22673/1678782-22673679.pdf?src-supplier=Element14; Supplier Part Number 1: 667-ERJ-2RKF1500X
R13 R17 R18 R21 = ERJ-2RKF4701X: Res Thick Film 0402 4.7K Ohm 1% 1/10W Â±100ppm/Â°C Molded SMD SMD Punched Carrier T/R; Manufacturer: Panasonic; Resistance: 4.7kR; Temperature Coefficient: 100ppm/°C; Power Rating: 100mW; Voltage Rating: 50V; Supplier 1: Mouser; Manufacturer Part Number: ERJ-2RKF4701X; RoHS: Yes; Category: Chip SMD Resistors; Stock 1: 689601; Pricing 1: 1=0,10000, 10=0,02200, 50=0,02200, 100=0,00900, 1000=0,00400, 10000=0,00300 (USD); Mount: Surface Mount; Case/Package: 0402; Number of Pins: 2; Contact Plating: Tin; Case Code (Metric): 1005; Case Code (Imperial): 0402; Weight: 0.000388oz; Min Operating Temperature: -55°C; Max Operating Temperature: 155°C; Tolerance: 1%; Resistor Type: Thick Film; Packaging: Cut Tape; Package Quantity: 10000; Number of Terminations: 2; Termination: SMD/SMT; Max Power Dissipation: 100mW; Voltage Rating (DC): 50V; Features: Automotive AEC-Q200; Series: ERJ-2Rx; Technology: THICK FILM; Length: 1mm; Width: 0.5mm; Height: 0.35mm; Depth: 0.5mm; Radiation Hardening: No; Lead Free: Lead Free; REACH SVHC: No SVHC; Military Standard: Not; RoHS Compliant: Yes; ComponentLink1URL: https://datasheet.ciiva.com/11821/0900766b80f80784-11821329.pdf?src-supplier=RSComponents; ComponentLink1Description: https://datasheet.ciiva.com/11821/0900766b80f80784-11821329.pdf?src-supplier=RSComponents; ComponentLink2URL: https://datasheet.ciiva.com/30053/aoa0000ce2-30053990.pdf?src-supplier=Onlinecomponents.com; ComponentLink2Description: https://datasheet.ciiva.com/30053/aoa0000ce2-30053990.pdf?src-supplier=Onlinecomponents.com; ComponentLink3URL: https://datasheet.ciiva.com/7830/aoa0000ce2-7830727.pdf?src-supplier=Element14; ComponentLink3Description: https://datasheet.ciiva.com/7830/aoa0000ce2-7830727.pdf?src-supplier=Element14; ComponentLink4URL: https://datasheet.ciiva.com/22781/1678782-22781576.pdf?src-supplier=Farnell; ComponentLink4Description: https://datasheet.ciiva.com/22781/1678782-22781576.pdf?src-supplier=Farnell; ComponentLink5URL: https://datasheet.ciiva.com/9195/aoa0000ce2-9195737.pdf?src-supplier=Avnet; ComponentLink5Description: https://datasheet.ciiva.com/9195/aoa0000ce2-9195737.pdf?src-supplier=Avnet; ComponentLink6URL: https://datasheet.ciiva.com/17213/aoa0000ce2-17213180.pdf?src-supplier=Avnet+Europe; ComponentLink6Description: https://datasheet.ciiva.com/17213/aoa0000ce2-17213180.pdf?src-supplier=Avnet+Europe; ComponentLink7URL: https://datasheet.ciiva.com/22667/1678782-22667886.pdf?src-supplier=Element14; ComponentLink7Description: https://datasheet.ciiva.com/22667/1678782-22667886.pdf?src-supplier=Element14; ComponentLink8URL: https://datasheet.ciiva.com/16763/70260748-16763151.pdf?src-supplier=Allied+Electronics; ComponentLink8Description: https://datasheet.ciiva.com/16763/70260748-16763151.pdf?src-supplier=Allied+Electronics; ComponentLink9URL: https://datasheet.ciiva.com/22723/1678782-22723903.pdf?src-supplier=Element14; ComponentLink9Description: https://datasheet.ciiva.com/22723/1678782-22723903.pdf?src-supplier=Element14; ComponentLink10URL: https://datasheet.ciiva.com/24025/aoa0000ce2-24025663.pdf?src-supplier=Mouser; ComponentLink10Description: https://datasheet.ciiva.com/24025/aoa0000ce2-24025663.pdf?src-supplier=Mouser; Supplier Part Number 1: 667-ERJ-2RKF4701X
R14 R16 R20 R22 = CRCW040247K0FKED: Resistor;  Thick Film;  47 Kilohms;  0.063 W;  1%;  SMT;  0402;  TCR 37 ppm/DegC; Manufacturer: Vishay; Resistance: 47kR; Temperature Coefficient: 100ppm/°C; Power Rating: 63mW; Voltage Rating: 50V; Supplier 1: Mouser; Manufacturer Part Number: CRCW040247K0FKED; RoHS: Yes; Category: Chip SMD Resistors; Stock 1: 40176; Pricing 1: 1=0,10000, 10=0,03300, 50=0,03300, 100=0,01400, 1000=0,00500, 10000=0,00500 (USD); Mount: Surface Mount; Case/Package: 0402; Contact Plating: Tin; Weight: 2.3E-05oz; Case Code (Imperial): 0402; Case Code (Metric): 1005; Min Operating Temperature: -55°C; Max Operating Temperature: 155°C; Resistor Type: Thick Film; Tolerance: 1%; Termination: SMD/SMT; Packaging: Tape and Reel; Package Quantity: 10000; Number of Terminations: 2; Features: Automotive AEC-Q200; Series: CRCW; Max Power Dissipation: 63mW; Technology: THICK FILM; Construction: Rectangular; Voltage Rating (DC): 50V; Working Voltage: 50V; Resistance Tolerance: 1%; Length: 1mm; Width: 0.5mm; Height: 0.35mm; Depth: 0.5mm; Radiation Hardening: No; Lead Free: Lead Free; RoHS Compliant: Yes; Military Standard: Not; REACH SVHC: Unknown; ComponentLink1URL: https://datasheet.ciiva.com/11808/0900766b80d98824-11808993.pdf?src-supplier=RSComponents; ComponentLink1Description: https://datasheet.ciiva.com/11808/0900766b80d98824-11808993.pdf?src-supplier=RSComponents; ComponentLink2URL: https://datasheet.ciiva.com/5543/dcrcwe3-109170-5543015.pdf?src-supplier=Mouser; ComponentLink2Description: https://datasheet.ciiva.com/5543/dcrcwe3-109170-5543015.pdf?src-supplier=Mouser; ComponentLink3URL: https://datasheet.ciiva.com/16768/70201119-16768855.pdf?src-supplier=Allied+Electronics; ComponentLink3Description: https://datasheet.ciiva.com/16768/70201119-16768855.pdf?src-supplier=Allied+Electronics; ComponentLink4URL: https://datasheet.ciiva.com/7777/1720486-7777545.pdf?src-supplier=Element14; ComponentLink4Description: https://datasheet.ciiva.com/7777/1720486-7777545.pdf?src-supplier=Element14; ComponentLink5URL: https://datasheet.ciiva.com/3256/dcrcwe3-3256558.pdf?src-supplier=Avnet; ComponentLink5Description: https://datasheet.ciiva.com/3256/dcrcwe3-3256558.pdf?src-supplier=Avnet; ComponentLink6URL: https://datasheet.ciiva.com/3256/dcrcwe3-3256559.pdf?src-supplier=Avnet; ComponentLink6Description: https://datasheet.ciiva.com/3256/dcrcwe3-3256559.pdf?src-supplier=Avnet; ComponentLink7URL: https://datasheet.ciiva.com/7777/1697337-7777247.pdf?src-supplier=Element14; ComponentLink7Description: https://datasheet.ciiva.com/7777/1697337-7777247.pdf?src-supplier=Element14; Supplier Part Number 1: 71-CRCW0402-47K-E3
R15 = CRCW0402-10K0FKED: Res Thick Film 0402 10K Ohm 1% 1/16W ±100ppm/°C Molded SMD Paper T/R; Manufacturer: Vishay; Power Rating: 63mW; Resistance: 10kR; Voltage Rating: 50V; Supplier 1: Mouser; Manufacturer Part Number: CRCW0402-10K0FKED; RoHS: Yes; Category: Chip SMD Resistors; Stock 1: 1711719; Pricing 1: 1=0,100000, 10=0,033000, 50=0,033000, 100=0,014000, 1000=0,006000, 10000=0,005000 (USD); Mount: Surface Mount; Case/Package: 0402; Number of Pins: 2; Contact Plating: Tin; Weight: 2.3E-05oz; Case Code (Metric): 1005; Case Code (Imperial): 0402; Min Operating Temperature: -55°C; Max Operating Temperature: 155°C; Tolerance: 1%; Resistor Type: Thick Film; Temperature Coefficient: 100ppm/°C; Termination: SMD/SMT; Package Quantity: 10; Packaging: Tape and Reel; Number of Terminations: 2; Max Power Dissipation: 63mW; Voltage Rating (DC): 50V; Features: Automotive AEC-Q200; Length: 1mm; Width: 0.02inch; Height: 0.35mm; Depth: 0.5mm; Radiation Hardening: No; Lead Free: Lead Free; REACH SVHC: Unknown; Military Standard: Not; ComponentLink1URL: https://datasheet.ciiva.com/11809/0900766b80d98824-11809984.pdf?src-supplier=RSComponents; ComponentLink1Description: https://datasheet.ciiva.com/11809/0900766b80d98824-11809984.pdf?src-supplier=RSComponents; ComponentLink2URL: https://datasheet.ciiva.com/2463/dcrcwe3-2463025.pdf?src-supplier=Digi-Key; ComponentLink2Description: https://datasheet.ciiva.com/2463/dcrcwe3-2463025.pdf?src-supplier=Digi-Key; ComponentLink3URL: https://datasheet.ciiva.com/2463/dcrcwe3-2463026.pdf?src-supplier=Digi-Key; ComponentLink3Description: https://datasheet.ciiva.com/2463/dcrcwe3-2463026.pdf?src-supplier=Digi-Key; ComponentLink4URL: https://datasheet.ciiva.com/2463/dcrcwe3-2463027.pdf?src-supplier=Digi-Key; ComponentLink4Description: https://datasheet.ciiva.com/2463/dcrcwe3-2463027.pdf?src-supplier=Digi-Key; ComponentLink5URL: https://datasheet.ciiva.com/46385/1697337-46385560.pdf?src-supplier=Element14; ComponentLink5Description: https://datasheet.ciiva.com/46385/1697337-46385560.pdf?src-supplier=Element14; ComponentLink6URL: https://datasheet.ciiva.com/3255/dcrcwe3-3255961.pdf?src-supplier=Avnet; ComponentLink6Description: https://datasheet.ciiva.com/3255/dcrcwe3-3255961.pdf?src-supplier=Avnet; ComponentLink7URL: https://datasheet.ciiva.com/3255/dcrcwe3-3255962.pdf?src-supplier=Avnet; ComponentLink7Description: https://datasheet.ciiva.com/3255/dcrcwe3-3255962.pdf?src-supplier=Avnet; ComponentLink8URL: https://datasheet.ciiva.com/5547/dcrcwe3-109170-5547786.pdf?src-supplier=Mouser; ComponentLink8Description: https://datasheet.ciiva.com/5547/dcrcwe3-109170-5547786.pdf?src-supplier=Mouser; ComponentLink9URL: https://datasheet.ciiva.com/26316/fld-crcw-e3-data-en-26316618.pdf?src-supplier=Distrelec; ComponentLink9Description: https://datasheet.ciiva.com/26316/fld-crcw-e3-data-en-26316618.pdf?src-supplier=Distrelec; ComponentLink10URL: https://datasheet.ciiva.com/16208/dcrcwe3-16208525.pdf?src-supplier=Future+Electronics; ComponentLink10Description: https://datasheet.ciiva.com/16208/dcrcwe3-16208525.pdf?src-supplier=Future+Electronics; ComponentLink11URL: https://datasheet.ciiva.com/36856/1720486-36856909.pdf?src-supplier=Element14; ComponentLink11Description: https://datasheet.ciiva.com/36856/1720486-36856909.pdf?src-supplier=Element14; Supplier Part Number 1: 71-CRCW0402-10K-E3
R19 = RC0402FR-072K4L: Res Thick Film 0402 2.4K Ohm 1% 0.063W(1/16W) ±100ppm/C Epoxy Pad SMD T/R; Manufacturer: Yageo; Resistance: 2.4kR; Power Rating: 63mW; Voltage Rating: 50V; Temperature Coefficient: 100ppm/°C; Supplier 1: Mouser; Manufacturer Part Number: RC0402FR-072K4L; RoHS: Yes; Category: Chip SMD Resistors; Stock 1: 2143; Pricing 1: 1=0,10000, 10=0,01200, 50=0,01200, 100=0,00400, 1000=0,00400, 10000=0,00300 (USD); Case/Package: 0402; Case Code (Metric): 1005; Case Code (Imperial): 0402; Size Code: 0402; Min Operating Temperature: -55°C; Max Operating Temperature: 155°C; Packaging: Tape and Reel; Tolerance: 1%; Package Quantity: 1; Resistor Type: Thick Film; Number of Terminations: 2; Termination: SMD/SMT; Max Power Dissipation: 63mW; Voltage Rating (DC): 50V; Features: Moisture Resistant; Series: RC; Construction: Rectangular; Resistance Tolerance: 1%; Length: 1mm; Width: 0.02inch; Height: 0.016inch; Depth: 0.5mm; REACH SVHC: Unknown; Military Standard: Not; Lead Free: Lead Free; RoHS Compliant: Yes; ComponentLink1URL: https://datasheet.ciiva.com/2453/pyu-r-int-thick-7-2453427.pdf?src-supplier=Digi-Key; ComponentLink1Description: https://datasheet.ciiva.com/2453/pyu-r-int-thick-7-2453427.pdf?src-supplier=Digi-Key; ComponentLink2URL: https://datasheet.ciiva.com/2453/pyu-r-int-thick-7-2453428.pdf?src-supplier=Digi-Key; ComponentLink2Description: https://datasheet.ciiva.com/2453/pyu-r-int-thick-7-2453428.pdf?src-supplier=Digi-Key; ComponentLink3URL: https://datasheet.ciiva.com/2453/pyu-r-int-thick-7-2453429.pdf?src-supplier=Digi-Key; ComponentLink3Description: https://datasheet.ciiva.com/2453/pyu-r-int-thick-7-2453429.pdf?src-supplier=Digi-Key; ComponentLink4URL: https://datasheet.ciiva.com/7849/1018594-7849930.pdf?src-supplier=Element14; ComponentLink4Description: https://datasheet.ciiva.com/7849/1018594-7849930.pdf?src-supplier=Element14; ComponentLink5URL: https://datasheet.ciiva.com/7849/1018594-7849931.pdf?src-supplier=Element14; ComponentLink5Description: https://datasheet.ciiva.com/7849/1018594-7849931.pdf?src-supplier=Element14; ComponentLink6URL: https://datasheet.ciiva.com/17423/pyu-rc0402-51-rohs-l-6-r-17423915.pdf?src-supplier=Future+Electronics; ComponentLink6Description: https://datasheet.ciiva.com/17423/pyu-rc0402-51-rohs-l-6-r-17423915.pdf?src-supplier=Future+Electronics; ComponentLink7URL: https://datasheet.ciiva.com/12667/pyu-rc0402-51-rohs-l-6-r-12667437.pdf?src-supplier=Mouser; ComponentLink7Description: https://datasheet.ciiva.com/12667/pyu-rc0402-51-rohs-l-6-r-12667437.pdf?src-supplier=Mouser; Supplier Part Number 1: 603-RC0402FR-072K4L
R23 = CRG0402F5K6: TE Connectivity CRG0402 Series Thick Film Surface Mount Resistor 0402 Case 5.6k 1% 0.063W 100ppm/C; Resistance: 5.6kR; Temperature Coefficient: 100ppm/°C; Power Rating: 63mW; Voltage Rating: 50V; Number of Resistors: 1; Supplier 1: Mouser; Manufacturer: TE Connectivity; Manufacturer Part Number: CRG0402F5K6; RoHS: Yes; Category: Chip SMD Resistors; Pricing 1: 10000=0,00200 (USD); Mount: Surface Mount; Case/Package: 0402; Case Code (Imperial): 0402; Case Code (Metric): 1005; Weight: 2.3E-05oz; Min Operating Temperature: -55°C; Max Operating Temperature: 125°C; Packaging: Tape and Reel; Tolerance: 1%; Resistor Type: Thick Film; Package Quantity: 10000; Number of Terminations: 2; Termination: Solder; Voltage Rating (DC): 50V; Length: 1mm; Width: 0.5mm; Height: 0.35mm; Depth: 0.5mm; REACH SVHC: No SVHC; ELV: Compliant; ComponentLink1URL: https://datasheet.ciiva.com/11811/0900766b80d0914d-11811373.pdf?src-supplier=RSComponents; ComponentLink1Description: https://datasheet.ciiva.com/11811/0900766b80d0914d-11811373.pdf?src-supplier=RSComponents; ComponentLink2URL: https://datasheet.ciiva.com/46386/1610603-46386187.pdf?src-supplier=Element14; ComponentLink2Description: https://datasheet.ciiva.com/46386/1610603-46386187.pdf?src-supplier=Element14; ComponentLink3URL: https://datasheet.ciiva.com/22706/1610603-22706136.pdf?src-supplier=Element14; ComponentLink3Description: https://datasheet.ciiva.com/22706/1610603-22706136.pdf?src-supplier=Element14; Supplier Part Number 1: 279-CRG0402F5K6
R24 R25 = RC0402FR-132K2L: Thick Film Resistors - SMD 2.2K OHM 1%; Manufacturer: Yageo; Resistance: 2.2kR; Temperature Coefficient: 100ppm/°C; Power Rating: 62.5mW; Voltage Rating: 50V; Supplier 1: Mouser; Manufacturer Part Number: RC0402FR-132K2L; RoHS: Yes; Category: Chip SMD Resistors; Stock 1: 99082; Pricing 1: 1=0,10000, 10=0,01200, 50=0,01200, 100=0,00400, 1000=0,00400, 10000=0,00400 (USD); Case/Package: 0402; Contact Plating: Tin,Matte; Case Code (Imperial): 0402; Case Code (Metric): 1005; Min Operating Temperature: -55°C; Max Operating Temperature: 155°C; Tolerance: 1%; Resistor Type: Thick Film; Packaging: Tape and Reel; Termination: SMD/SMT; Series: RC; Construction: Rectangular; Length: 1mm; Width: 0.5mm; Height: 0.35mm; Depth: 0.5mm; Radiation Hardening: No; Military Standard: Not; RoHS Compliant: Yes; ComponentLink1URL: https://datasheet.ciiva.com/8894/pyu-rc0402-51-rohs-l-6-8894632.pdf?src-supplier=Avnet; ComponentLink1Description: https://datasheet.ciiva.com/8894/pyu-rc0402-51-rohs-l-6-8894632.pdf?src-supplier=Avnet; ComponentLink2URL: https://datasheet.ciiva.com/16865/pyu-rc0402-51-rohs-l-6-16865051.pdf?src-supplier=Avnet+Europe; ComponentLink2Description: https://datasheet.ciiva.com/16865/pyu-rc0402-51-rohs-l-6-16865051.pdf?src-supplier=Avnet+Europe; ComponentLink3URL: https://datasheet.ciiva.com/12575/pyu-rc0402-51-rohs-l-6-r-8721-12575132.pdf?src-supplier=Mouser; ComponentLink3Description: https://datasheet.ciiva.com/12575/pyu-rc0402-51-rohs-l-6-r-8721-12575132.pdf?src-supplier=Mouser; Supplier Part Number 1: 603-RC0402FR-132K2L
R42 = RC0603JR-130RL: YAGEO - RC0603JR-130RL - RES, THICK FILM, 0R, 0.1W, 0603; Resistance: 0mR; Power Rating: 100mW; Voltage Rating: 50V; Tolerance: 1%; Temperature Coefficient: 200ppm/°C; Supplier 1: Mouser; Manufacturer: Yageo; Manufacturer Part Number: RC0603JR-130RL; RoHS: Yes; Category: Chip SMD Resistors; Stock 1: 5989; Pricing 1: 1=0,10000, 10=0,01500, 50=0,01500, 100=0,00500, 1000=0,00500, 10000=0,00500 (USD); Case/Package: 0603; Number of Pins: 2; Case Code (Imperial): 0603; Case Code (Metric): 1608; Contact Plating: Tin,Matte; Size Code: 0603; Min Operating Temperature: -55°C; Max Operating Temperature: 155°C; Packaging: Tape and Reel; Package Quantity: 5000; Resistor Type: Thick Film; Termination: SMD/SMT; Voltage Rating (DC): 50V; Series: RC; Construction: Rectangular; Length: 1.6mm; Width: 0.8mm; Height: 0.45mm; Depth: 0.8mm; Radiation Hardening: No; REACH SVHC: No SVHC; Military Standard: Not; Lead Free: Lead Free; RoHS Compliant: Yes; ComponentLink1URL: https://datasheet.ciiva.com/7983/443971-7983749.pdf?src-supplier=Element14; ComponentLink1Description: https://datasheet.ciiva.com/7983/443971-7983749.pdf?src-supplier=Element14; ComponentLink2URL: https://datasheet.ciiva.com/46395/443971-46395125.pdf?src-supplier=Element14; ComponentLink2Description: https://datasheet.ciiva.com/46395/443971-46395125.pdf?src-supplier=Element14; Supplier Part Number 1: 603-RC0603JR-130RL
XTAL1 = XRCHA16M000F0A12R0: Crystal 16MHz ±100ppm (Tol) ±100ppm (Stability) 8pF 100Ohm Automotive 2-Pin SMD T/R; Manufacturer: Murata; Supplier 1: Mouser; Manufacturer Part Number: XRCHA16M000F0A12R0; RoHS: Yes; Stock 1: 50; Pricing 1: 1=0,65000, 10=0,57100, 50=0,51300, 100=0,45700, 1000=0,36500, 10000=0,30400 (USD); RoHS Compliant: Yes; ComponentLink1URL: http://www.mouser.com/ds/2/281/p79e-806516.pdf?src-supplier=Mouser; ComponentLink1Description: http://www.mouser.com/ds/2/281/p79e-806516.pdf?src-supplier=Mouser; Supplier Part Number 1: 81-XRCHA16M000F0A120
Z2 = MM3Z3V9ST1G: ON SEMICONDUCTOR - MM3Z3V9ST1G - Zener Single Diode, 3.9 V, 300 mW, SOD-323, 5 %, 2 Pins, 150 °C; Max Power Dissipation: 200mW; Tolerance: 2%; Zener Voltage: 4.025V; Impedance: 90R; Voltage Tolerance: 3%; Max Reverse Leakage Current: 3uA; Test Current: 5mA; ESD Protection: Yes; Supplier 1: Mouser; Manufacturer: ON Semiconductor; Manufacturer Part Number: MM3Z3V9ST1G; RoHS: Yes; Category: Zener Diodes; Stock 1: 32042; Pricing 1: 1=0,14000, 10=0,12500, 50=0,12500, 100=0,04400, 1000=0,03000, 10000=0,02000 (USD); Case/Package: SOD-323-2; Number of Pins: 2; Material: Plastic; Contact Plating: Tin,Matte; Min Operating Temperature: -65°C; Max Operating Temperature: 150°C; Packaging: Tape and Reel; Package Quantity: 3000; Element Configuration: Single; Voltage Rating (DC): 3.9V; Power Rating: 200mW; Power Dissipation: 200mW; Series: -; Length: 1.8mm; Width: 1.35mm; Height: 1mm; Radiation Hardening: No; Lead Free: Lead Free; RoHS Compliant: Yes; ComponentLink1URL: https://datasheet.ciiva.com/899/mm3z2v4st1-d-899781.pdf?src-supplier=Digi-Key; ComponentLink1Description: https://datasheet.ciiva.com/899/mm3z2v4st1-d-899781.pdf?src-supplier=Digi-Key; Supplier Part Number 1: 863-MM3Z3V9ST1G

## Sheet OBD.SchDoc
size A3
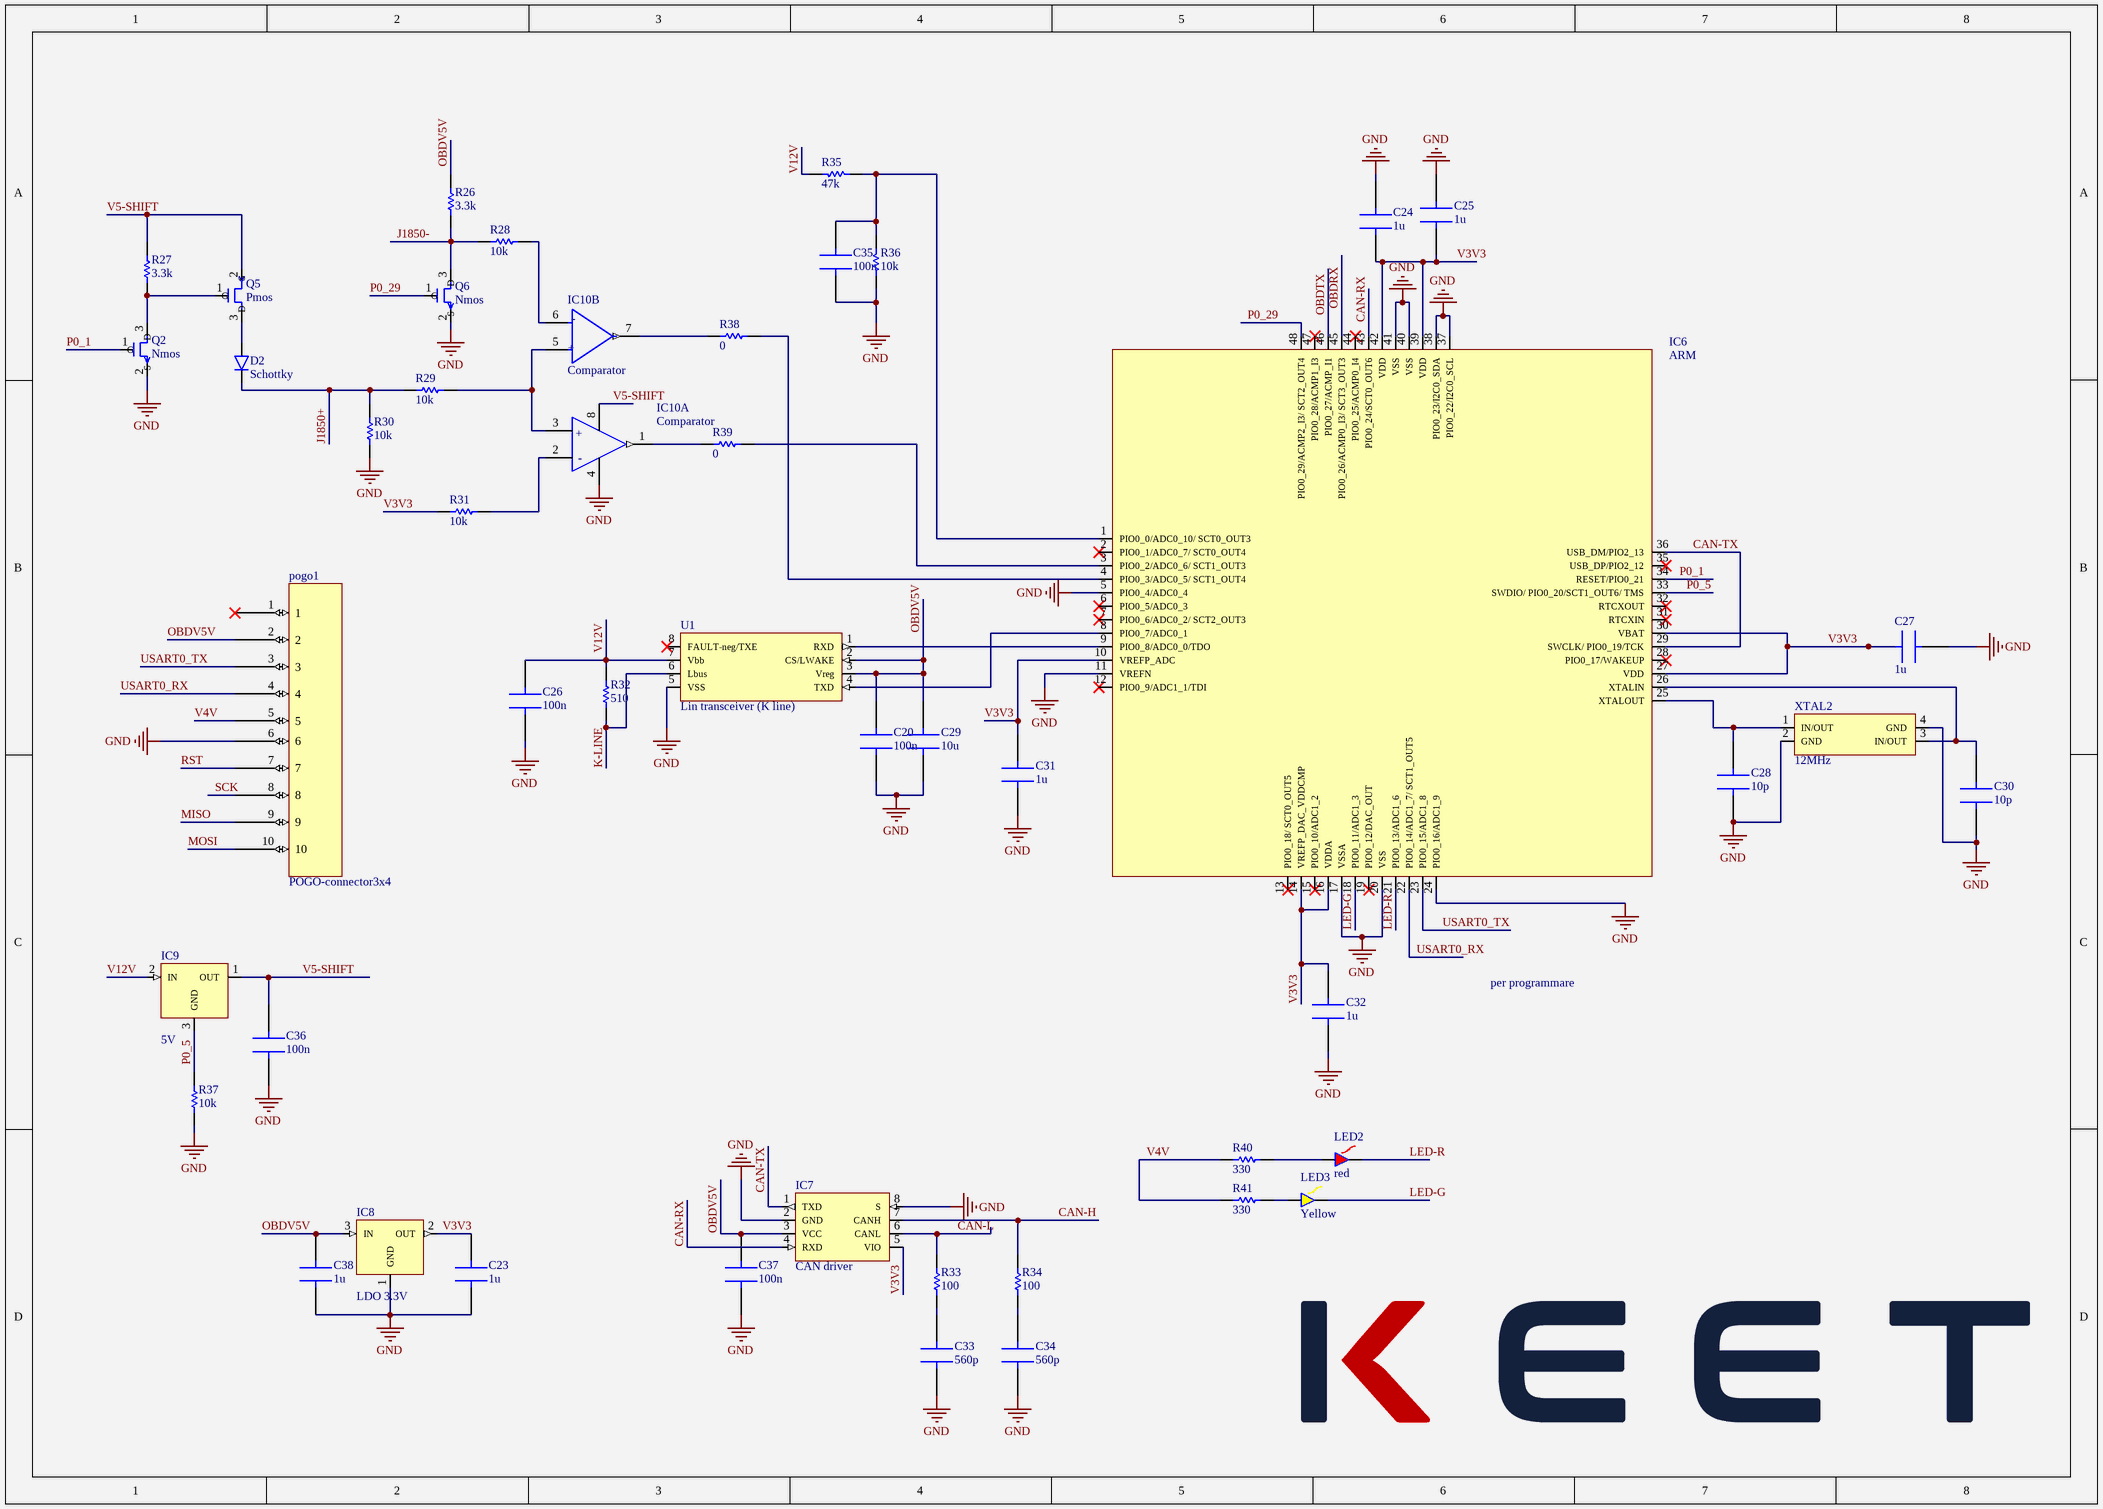
[diagram p2: OBD.SchDoc]